# Altium schematic sheet VCS_Git_Test_r2.SchDoc
size A4; SheetNumber: 1; SheetTotal: 1
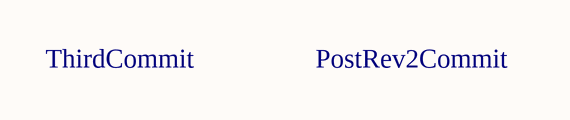
[diagram p0: VCS_Git_Test_r2.SchDoc]

## Notes on the sheet
- ThirdCommit
- PostRev2Commit